# EAGLE schematic JK-FlipFlop-countdown (EAGLE 9.6.2)
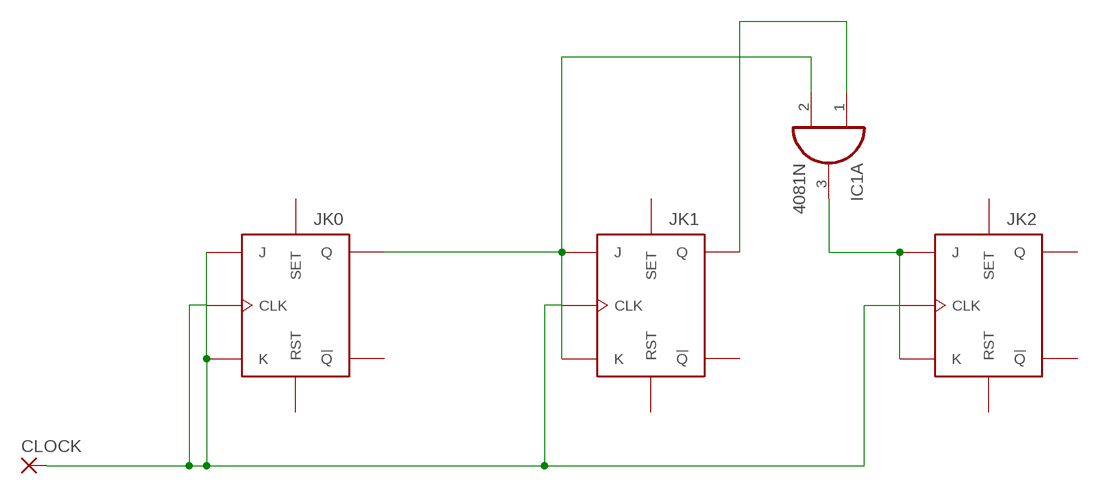
[diagram p0: schematic, sheet 1]

## Parts
CLOCK  1,6/0,8  [1,6/0,8]
IC1  4081N  [DIL14]
JK0  JKFF  (no package)
JK1  JKFF  (no package)
JK2  JKFF  (no package)

## Nets
N$1: IC1.1(A:I0) JK1.Q
N$4: CLOCK.1(P) JK0.CLK JK0.J JK0.K JK1.CLK JK2.CLK
N$5: IC1.2(A:I1) JK0.Q JK1.J JK1.K
N$6: IC1.3(A:O) JK2.J JK2.K
Unconnected: IC1.4(B:O) IC1.5(B:I0) IC1.6(B:I1) IC1.8(C:I0) IC1.9(C:I1) IC1.10(C:O) IC1.11(D:O) IC1.12(D:I0) IC1.13(D:I1) JK0.!Q JK0.RST JK0.SET JK1.!Q JK1.RST JK1.SET JK2.!Q JK2.Q JK2.RST JK2.SET

## Power pins joined to a net without a drawn wire
VDD: IC1.14(P:VDD)
VSS: IC1.7(P:VSS)

## Library data of the parts
CLOCK = wirepad:1,6/0,8: THROUGH-HOLE PAD
IC1 = 40xx:4081: Quad 2-input AND
JK0 JK1 JK2 = ngspice-digital:JKFF: JK TYPE FLIP FLOP